# EAGLE schematic Pull out testing jig (EAGLE 7.2.0)
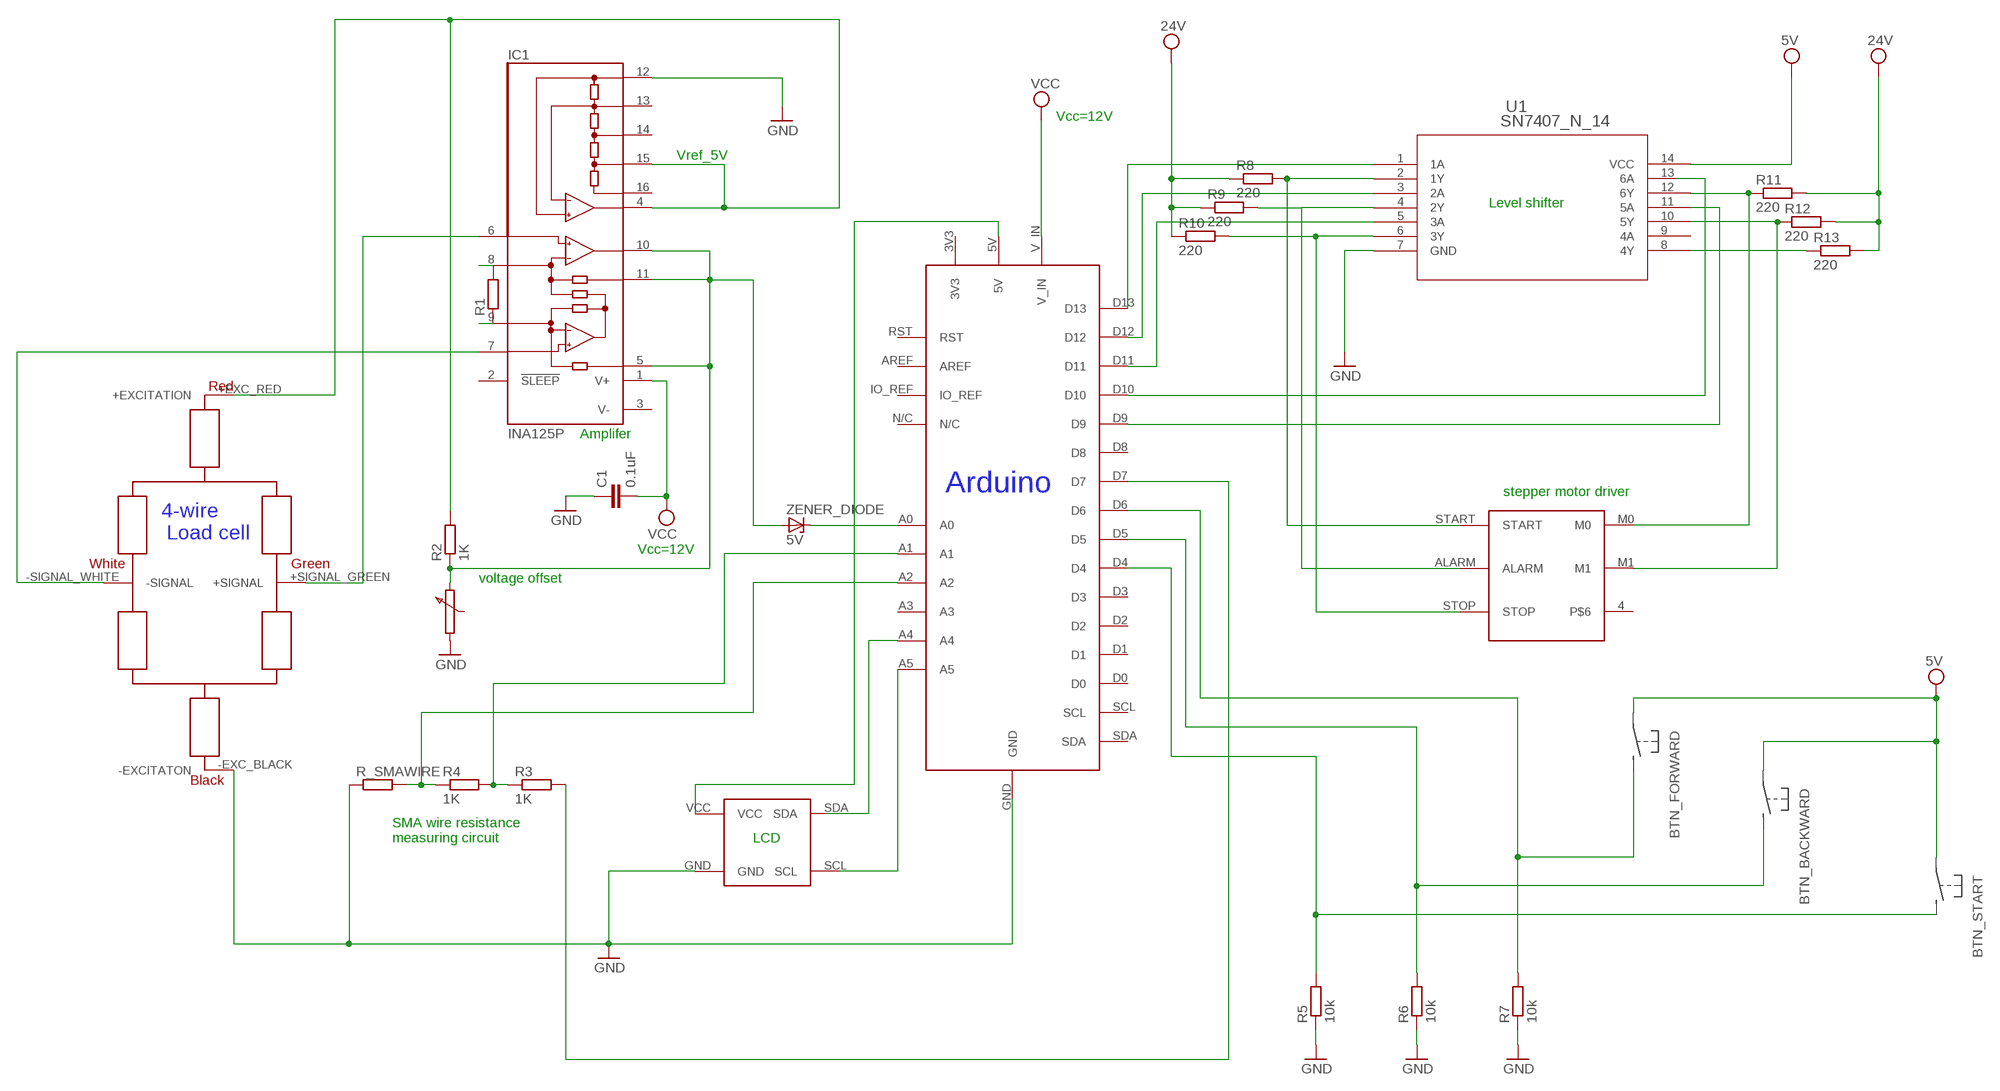
[diagram p0: schematic, sheet 1]

## Parts
C1  0.1uF  C-EU050-024X044  [C050-024X044]
IC1  INA125P  [DIL16]
R1  R-EU_0617/17  [0617/17]
R2  1K  R-EU_0207/7  [0207/7]
R3  1K  R-EU_0207/7  [0207/7]
R4  1K  R-EU_0207/7  [0207/7]
R5  10k  R-EU_0207/7  [0207/7]
R6  10k  R-EU_0207/7  [0207/7]
R7  10k  R-EU_0207/7  [0207/7]
R8  220  R-EU_0204/2V  [0204V]
R9  220  R-EU_0204/2V  [0204V]
R10  220  R-EU_0204/2V  [0204V]
R11  220  R-EU_0204/2V  [0204V]
R12  220  R-EU_0204/2V  [0204V]
R13  220  R-EU_0204/2V  [0204V]
R_SMAWIRE  R-EU_0207/7  [0207/7]
U1  SN7407_N_14  [N14]
U$1  ARDUINO_UNO  [ARDUINO_SCHEMATIC]
U$2  4_WIRE_LOADCELL  [4-WIRE_LOADCELL]
U$3  LCD  [LCD]
U$4  STEPMOTOR_IO  [STEPMOTOR_IO]
ZENER_DIODE  5V  ZENER-DIODESMB  [SMB]

## Nets
GND: C1.1 IC1.12(REFCOM) R5.1 R6.1 R7.1 R_SMAWIRE.1 U1.7(GND) U$1.GND U$2.-EXC_BLACK(-EXCITATON) U$3.GND
N$1: U$1.A0 ZENER_DIODE.C
N$2: IC1.5(REF) IC1.10(OUT) IC1.11(SENSE) R2.1 ZENER_DIODE.A
N$3: IC1.4(REFOUT) IC1.15(REF5) R2.2 U$2.+EXC_RED(+EXCITATION)
N$4: U$1.A4
N$5: U$1.A5 U$3.SCL
N$6: IC1.6(+IN) U$2.+SIGNAL_GREEN(+SIGNAL)
N$7: IC1.7(-IN) U$2.-SIGNAL_WHITE(-SIGNAL)
N$8: IC1.8(RG) R1.2
N$9: IC1.9(RG) R1.1
N$10: U1.1(1A) U$1.D13
N$11: R8.2 U1.2(1Y) U$4.START
N$12: U1.3(2A) U$1.D12
N$13: R9.2 U1.4(2Y) U$4.ALARM
N$14: U1.5(3A) U$1.D11
N$15: R10.2 U1.6(3Y) U$4.STOP
N$16: U$1.D10
N$17: R11.1 U1.12(6Y) U$4.M0
N$18: U1.11(5A) U$1.D9
N$19: R12.1 U1.10(5Y) U$4.M1
N$20: R4.1 R_SMAWIRE.2 U$1.A2
N$21: U$1.5V U$3.VCC
N$22: R3.1 R4.2 U$1.A1
N$23: R3.2 U$1.D7
N$24: R5.2 U$1.D4
N$25: R6.2 U$1.D5
N$26: R7.2 U$1.D6
N$27: R13.1 U1.8(4Y)
VCC: C1.2 IC1.1(V+) R8.1 R9.1 R10.1 R11.2 R12.2 R13.2 U1.14(VCC) U$1.V_IN ; supply symbol labelled 24V, 5V
Unconnected: IC1.2(!SLEEP) IC1.13(REFBG) IC1.14(REF2.5) IC1.16(REF10) U1.9(4A) U1.13(6A) U$1.3V3 U$1.A3 U$1.AREF U$1.D0 U$1.D1 U$1.D2 U$1.D3 U$1.D8 U$1.IO_REF U$1.N/C U$1.RST U$1.SCL U$1.SDA U$3.SDA U$4.4

## Notes on the sheet
- Vcc=12V
- Vref_5V
- Level shifter
- Amplifer
- stepper motor driver
- Vcc=12V
- voltage offset
- SMA wire resistance
  measuring circuit
- LCD

## Power pins joined to a net without a drawn wire
V-: IC1.3(V-)

## Library data of the parts
C1 = rcl:C-EU: CAPACITOR, European symbol
IC1 = burr-brown:INA125: Instrumentation Amplifier with Precision Voltage Reference; MF: TEXAS INSTRUMENT CONNECTORS; MPN: INA125P; OC_FARNELL: 1459461; OC_NEWARK: 35C1726
R1 R8-R13 = resistor:R-EU_: RESISTOR, European symbol
R2-R7 R_SMAWIRE = rcl:R-EU_: RESISTOR, European symbol
U1 = SN7407N:SN7407_N_14; DATASHEETURL: http://www.ti.com/lit/gpn/SN7407; DESCRIPTION: Hex Buffers/Drivers With Open-Collector High-Voltage Outputs; FAMILY_NAME: NON-INVERTING BUFFER/DRIVER; GENERIC_PART_NUMBER: SN7407; INDUSTRY_STD_PKG_TYPE: PDIP; MANUFACTURER: Texas Instruments; PACKAGE_DESIGNATOR: N; PIN_COUNT: 14
U$1 = Arduino R3:ARDUINO_UNO
U$2 = 4-wire-loadcell:4_WIRE_LOADCELL
U$3 = LCD:LCD
U$4 = stepMotorIO:STEPMOTOR_IO
ZENER_DIODE = diode:ZENER-DIODE: Z-Diode